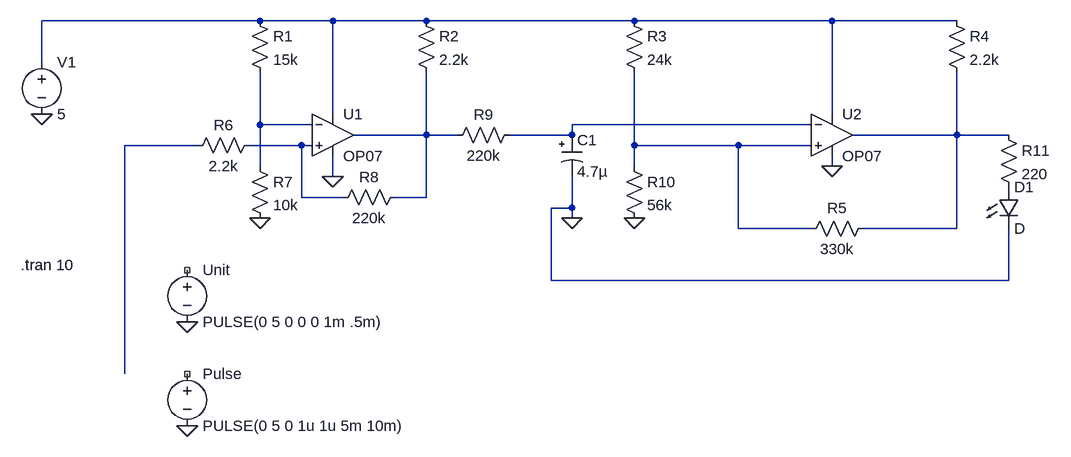
[diagram p0: schematic Inductive Load Activity Indicator .asc]
Inductive Load Activity Indicator .asc, the LTspice schematic file:
Version 4
SHEET 1 880 680
WIRE -672 -144 -1008 -144
WIRE -560 -144 -672 -144
WIRE -416 -144 -560 -144
WIRE -96 -144 -416 -144
WIRE 208 -144 -96 -144
WIRE 400 -144 208 -144
WIRE -1008 -80 -1008 -144
WIRE -560 0 -560 -144
WIRE 208 0 208 -144
WIRE -672 16 -672 -64
WIRE -592 16 -672 16
WIRE 176 16 -192 16
WIRE -416 32 -416 -64
WIRE -416 32 -528 32
WIRE -368 32 -416 32
WIRE -192 32 -192 16
WIRE -192 32 -288 32
WIRE 400 32 400 -64
WIRE 400 32 240 32
WIRE 480 32 400 32
WIRE -768 48 -880 48
WIRE -608 48 -688 48
WIRE -592 48 -608 48
WIRE -96 48 -96 -64
WIRE 64 48 -96 48
WIRE 176 48 64 48
WIRE -672 80 -672 16
WIRE -96 80 -96 48
WIRE 208 80 208 64
WIRE -560 96 -560 64
WIRE -608 128 -608 48
WIRE -544 128 -608 128
WIRE -416 128 -416 32
WIRE -416 128 -464 128
WIRE -192 144 -192 96
WIRE -192 144 -224 144
WIRE -192 160 -192 144
WIRE 64 176 64 48
WIRE 176 176 64 176
WIRE 400 176 400 32
WIRE 400 176 256 176
WIRE -224 256 -224 144
WIRE 480 256 480 176
WIRE 480 256 -224 256
WIRE -880 400 -880 48
FLAG 208 80 0
FLAG -560 96 0
FLAG -1008 0 0
FLAG -672 160 0
FLAG -96 160 0
FLAG -192 160 0
FLAG -784 320 0
FLAG -784 480 0
SYMBOL voltage -1008 -96 R0
SYMATTR InstName V1
SYMATTR Value 5
SYMBOL res -432 -160 R0
SYMATTR InstName R2
SYMATTR Value 2.2k
SYMBOL res -112 -160 R0
SYMATTR InstName R3
SYMATTR Value 24k
SYMBOL res 384 -160 R0
SYMATTR InstName R4
SYMATTR Value 2.2k
SYMBOL OpAmps\\OP07 -560 -32 R0
SYMATTR InstName U1
SYMBOL OpAmps\\OP07 208 -32 R0
SYMATTR InstName U2
SYMBOL res -112 64 R0
SYMATTR InstName R10
SYMATTR Value 56k
SYMBOL res 272 160 R90
WINDOW 0 0 56 VBottom 2
WINDOW 3 32 56 VTop 2
SYMATTR InstName R5
SYMATTR Value 330k
SYMBOL res -672 32 R90
WINDOW 0 0 56 VBottom 2
WINDOW 3 32 56 VTop 2
SYMATTR InstName R6
SYMATTR Value 2.2k
SYMBOL res -688 64 R0
SYMATTR InstName R7
SYMATTR Value 10k
SYMBOL res -688 -160 R0
SYMATTR InstName R1
SYMATTR Value 15k
SYMBOL res -448 112 R90
WINDOW 0 0 56 VBottom 2
WINDOW 3 32 56 VTop 2
SYMATTR InstName R8
SYMATTR Value 220k
SYMBOL res -272 16 R90
WINDOW 0 0 56 VBottom 2
WINDOW 3 32 56 VTop 2
SYMATTR InstName R9
SYMATTR Value 220k
SYMBOL polcap -208 32 R0
SYMATTR InstName C1
SYMATTR Value 4.7µ
SYMBOL voltage -784 224 R0
SYMATTR InstName Unit
SYMATTR Value PULSE(0 5 0 0 0 1m .5m)
SYMBOL voltage -784 384 R0
SYMATTR InstName Pulse
SYMATTR Value PULSE(0 5 0 1u 1u 5m 10m)
SYMBOL res 464 16 R0
SYMATTR InstName R11
SYMATTR Value 220
SYMBOL LED 464 112 R0
SYMATTR InstName D1
TEXT -1040 232 Left 2 !.tran 10

The netlist it stands for:
* Inductive Load Activity Indicator .asc
V1 N001 0 5
R2 N001 N004 2.2k
R3 N001 N008 24k
R4 N001 N005 2.2k
XU1 N007 N002 N001 0 N004 LT1001  ; OP07, pins In+ In- V+ V- OUT
XU2 N008 N003 N001 0 N005 LT1001  ; OP07, pins In+ In- V+ V- OUT
R10 N008 0 56k
R5 N005 N008 330k
R6 N007 N006 2.2k
R7 N002 0 10k
R1 N001 N002 15k
R8 N004 N007 220k
R9 N003 N004 220k
C1 N003 0 4.7µ
V§Unit NC_01 0 PULSE(0 5 0 0 0 1m .5m)
V§Pulse NC_02 0 PULSE(0 5 0 1u 1u 5m 10m)
R11 N005 P001 220
D1 P001 0 D
.model D D
.lib standard.dio
.tran 10
.lib LTC.lib
.backanno
.end